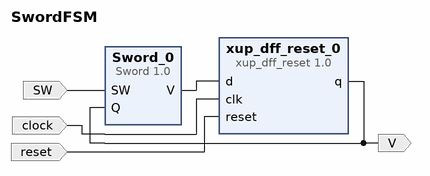
[diagram p0: block diagram of the top level]
# Vivado block design SwordFSM, xc7a100tcsg324-1, Vivado 2021.2
create_bd_design SwordFSM

create_bd_port -dir I clock
create_bd_port -dir I reset
create_bd_port -dir O V
create_bd_port -dir I SW

create_bd_cell -type ip -vlnv xilinx.com:user:Sword:1.0 Sword_0
create_bd_cell -type ip -vlnv xilinx.com:user:xup_dff_reset:1.0 xup_dff_reset_0

# ---- connections ----

connect_bd_net [get_bd_ports SW] [get_bd_pins Sword_0/SW]
connect_bd_net [get_bd_pins Sword_0/V] [get_bd_pins xup_dff_reset_0/d]
connect_bd_net [get_bd_ports clock] [get_bd_pins xup_dff_reset_0/clk]
connect_bd_net [get_bd_ports reset] [get_bd_pins xup_dff_reset_0/reset]
connect_bd_net [get_bd_pins xup_dff_reset_0/q] [get_bd_ports V] [get_bd_pins Sword_0/Q]

validate_bd_design
save_bd_design
